# EAGLE design NOS01 (EAGLE 7.2.0)
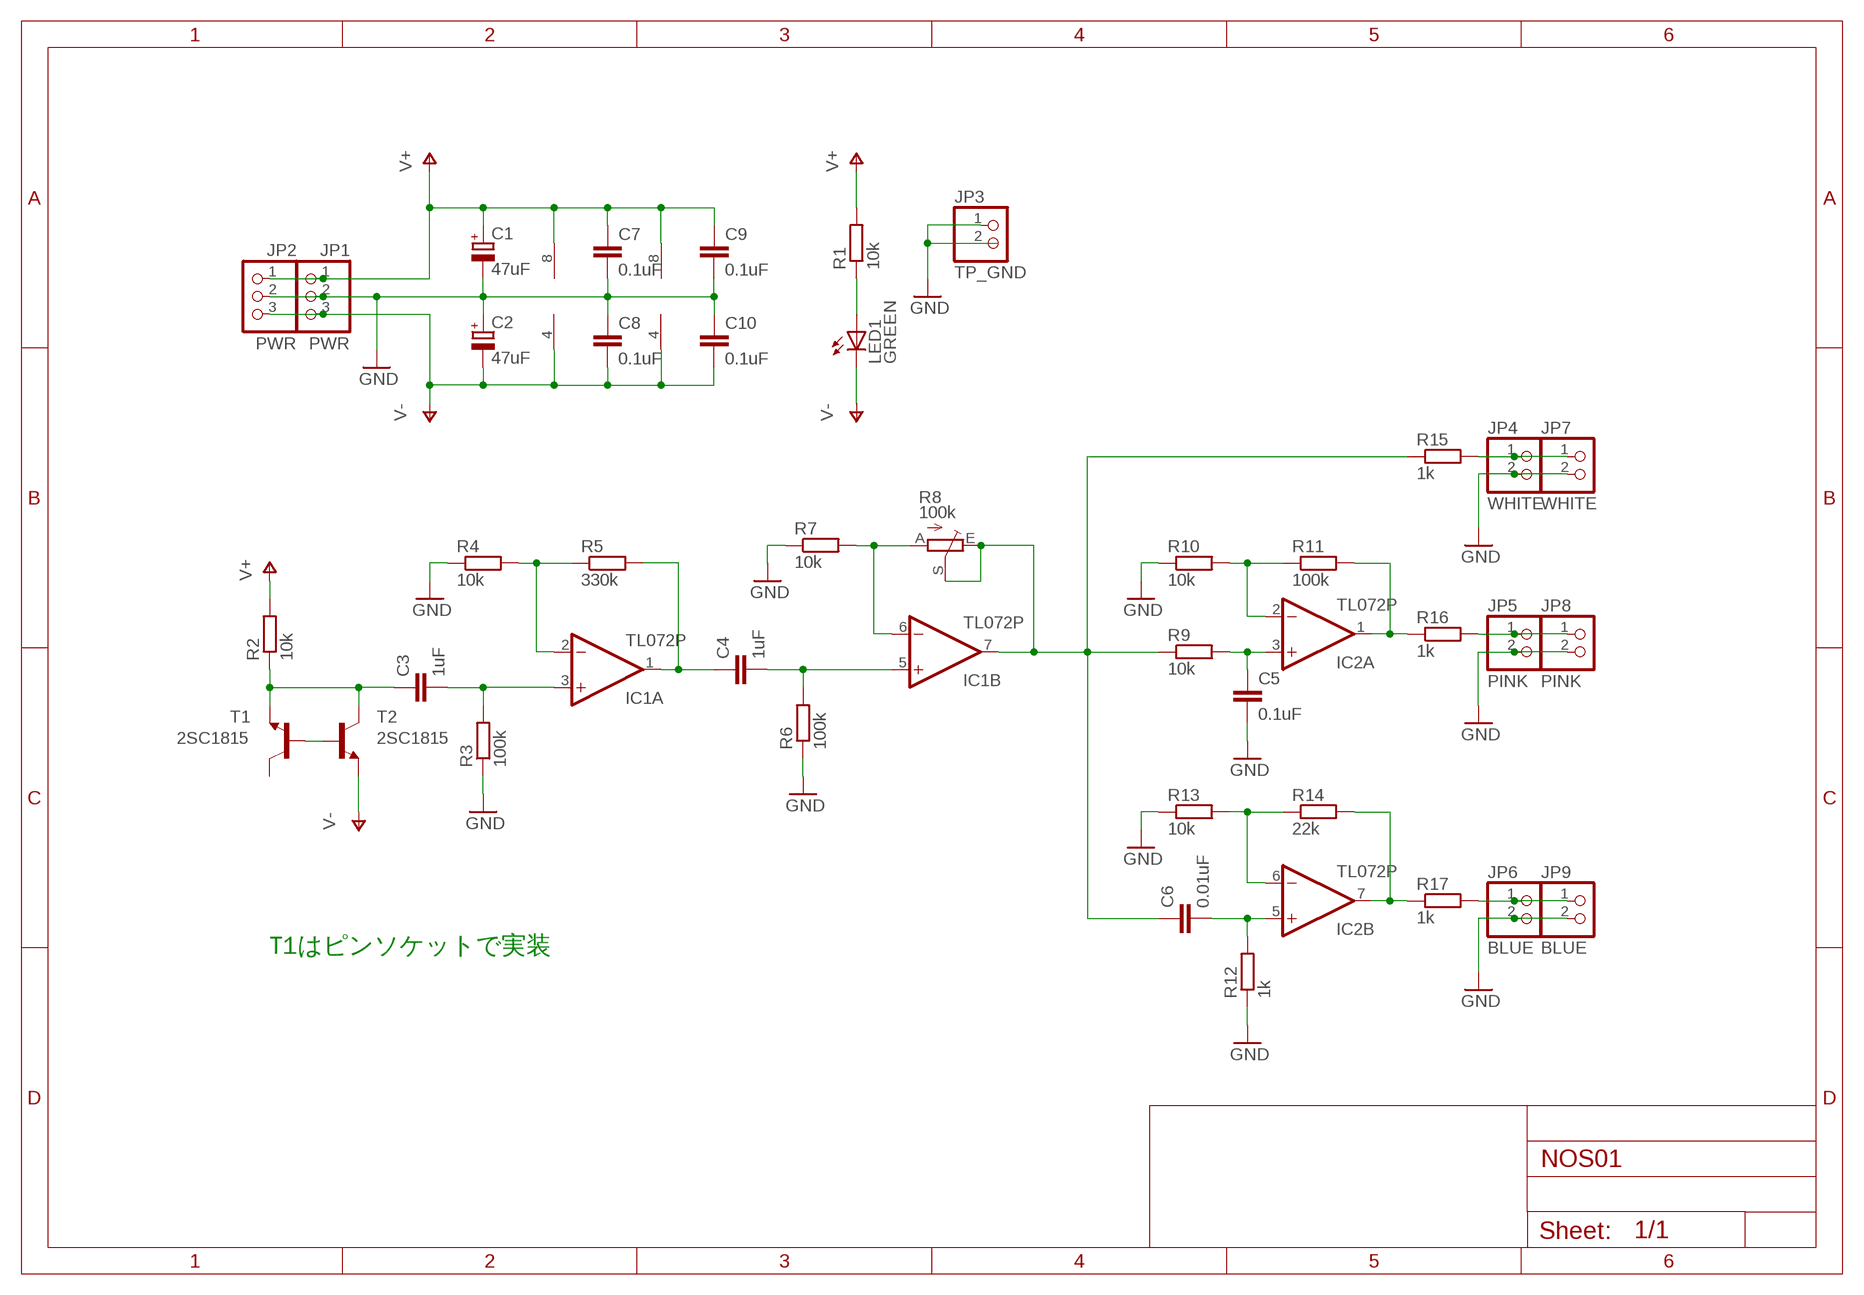
[diagram p0: schematic, sheet 1]

## Parts
C1  47uF  CPOL-EUE2.5-6  [E2,5-6]
C2  47uF  CPOL-EUE2.5-6  [E2,5-6]
C3  1uF  C-EU050-045X075  [C050-045X075]
C4  1uF  C-EU050-045X075  [C050-045X075]
C5  0.1uF  C-EU075-052X106  [C075-052X106]
C6  0.01uF  C-EU050-045X075  [C050-045X075]
C7  0.1uF  C-EU025-024X044  [C025-024X044]
C8  0.1uF  C-EU025-024X044  [C025-024X044]
C9  0.1uF  C-EU025-024X044  [C025-024X044]
C10  0.1uF  C-EU025-024X044  [C025-024X044]
IC1  TL072P  [DIL08]
IC2  TL072P  [DIL08]
JP1  PWR  PINHD-1X3  [1X03]
JP2  PWR  PINHD-1X3  [1X03]
JP3  TP_GND  PINHD-1X2  [1X02]
JP4  WHITE  PINHD-1X2  [1X02]
JP5  PINK  PINHD-1X2  [1X02]
JP6  BLUE  PINHD-1X2  [1X02]
JP7  WHITE  PINHD-1X2  [1X02]
JP8  PINK  PINHD-1X2  [1X02]
JP9  BLUE  PINHD-1X2  [1X02]
LED1  GREEN  LED3MM  [LED3MM]
R1  10k  R-EU_0207/7  [0207/7]
R2  10k  R-EU_0207/7  [0207/7]
R3  100k  R-EU_0207/7  [0207/7]
R4  10k  R-EU_0207/7  [0207/7]
R5  330k  R-EU_0207/7  [0207/7]
R6  100k  R-EU_0207/7  [0207/7]
R7  10k  R-EU_0207/7  [0207/7]
R8  100k  TRIM_EU-B25P  [B25P]
R9  10k  R-EU_0207/7  [0207/7]
R10  10k  R-EU_0207/7  [0207/7]
R11  100k  R-EU_0207/7  [0207/7]
R12  1k  R-EU_0207/7  [0207/7]
R13  10k  R-EU_0207/7  [0207/7]
R14  22k  R-EU_0207/7  [0207/7]
R15  1k  R-EU_0207/7  [0207/7]
R16  1k  R-EU_0207/7  [0207/7]
R17  1k  R-EU_0207/7  [0207/7]
T1  2SC1815  -NPN-TO92-ECB  [TO92-ECB]
T2  2SC1815  -NPN-TO92-ECB  [TO92-ECB]

## Nets
GND: C1.- C2.+ C5.2 C7.2 C8.1 C9.2 C10.1 JP1.2 JP2.2 JP3.1 JP3.2 JP4.2 JP5.2 JP6.2 JP7.2 JP8.2 JP9.2 R3.1 R4.1 R6.1 R7.1 R10.1 R12.1 R13.1
N$1: T1.B T2.B
N$2: C3.1 R2.1 T1.E T2.C
N$3: C3.2 IC1.3(A:+IN) R3.2
N$4: LED1.A R1.1
N$5: IC1.2(A:-IN) R4.2 R5.1
N$6: IC2.2(A:-IN) R10.2 R11.1
N$7: C4.1 IC1.1(A:OUT) R5.2
N$8: C4.2 IC1.5(B:+IN) R6.2
N$9: IC1.6(B:-IN) R7.2 R8.A
N$10: C6.1 IC1.7(B:OUT) R8.E R8.S R9.1 R15.1
N$11: IC2.1(A:OUT) R11.2 R16.1
N$12: JP5.1 JP8.1 R16.2
N$13: C5.1 IC2.3(A:+IN) R9.2
N$14: IC2.6(B:-IN) R13.2 R14.1
N$15: IC2.7(B:OUT) R14.2 R17.1
N$17: C6.2 IC2.5(B:+IN) R12.2
N$18: JP4.1 JP7.1 R15.2
N$21: JP6.1 JP9.1 R17.2
V+: C1.+ C7.1 C9.1 IC1.8(P:V+) IC2.8(P:V+) JP1.1 JP2.1 R1.2 R2.2
V-: C2.- C8.2 C10.2 IC1.4(P:V-) IC2.4(P:V-) JP1.3 JP2.3 LED1.K(C) T2.E
Unconnected: T1.C

## Notes on the sheet
- T1はピンソケットで実装

## Library data of the parts
C1 C2 = rcl:CPOL-EU: POLARIZED CAPACITOR, European symbol
C3-C10 = rcl:C-EU: CAPACITOR, European symbol
IC1 IC2 = linear:TL072: OP AMP
JP1 JP2 = pinhead:PINHD-1X3: PIN HEADER
JP3-JP9 = pinhead:PINHD-1X2: PIN HEADER
LED1 = led:LED: LED OSRAM: - CHIPLED LG R971, LG N971, LY N971, LG Q971, LY Q971, LO R971, LY R971 LH N974, LH R974 LS Q976, LO Q976, LY Q976 LO Q996 - Hyper CHIPLED LW Q18S LB Q993, LB Q99A, LB R99A - SideLED LS A670, LO A670, LY A670, LG A670, LP A670 LB A673, LV A673, LT A673, LW A673 LH A674 LY A675 LS A676, LA A676, LO A676, LY A676, LW A676 LS A679, LY A679, LG A679 - Hyper Micro SIDELED® LS Y876, LA Y876, LO Y876, LY Y876 LT Y87S - SmartLED LW L88C, LW L88S LB L89C, LB L89S, LG L890 LS L89K, LO L89K, LY L89K LS L896, LA L896, LO L896, LY L896 - TOPLED LS T670, LO T670, LY T670, LG T670, LP T670 LSG T670, LSP T670, LSY T670, LOP T670, LYG T670 LG T671, LOG T671, LSG T671 LB T673, LV T673, LT T673, LW T673 LH T674 LS T676, LA T676, LO T676, LY T676, LB T676, LH T676, LSB T676, LW T676 LB T67C, LV T67C, LT T67C, LS T67K, LO T67K, LY T67K, LW E67C LS E67B, LA E67B, LO E67B, LY E67B, LB E67C, LV E67C, LT E67C LW T67C LS T679, LY T679, LG T679 LS T770, LO T770, LY T770, LG T770, LP T770 LB T773, LV T773, LT T773, LW T773 LH T774 LS E675, LA E675, LY E675, LS T675 LS T776, LA T776, LO T776, LY T776, LB T776 LHGB T686 LT T68C, LB T68C - Hyper Mini TOPLED® LB M676 - Mini TOPLED Santana® LG M470 LS M47K, LO M47K, LY M47K Source: http://www.osram.convergy.de LUXEON: - LUMILED® LXK2-PW12-R00, LXK2-PW12-S00, LXK2-PW14-U00, LXK2-PW14-V00 LXK2-PM12-R00, LXK2-PM12-S00, LXK2-PM14-U00 LXK2-PE12-Q00, LXK2-PE12-R00, LXK2-PE12-S00, LXK2-PE14-T00, LXK2-PE14-U00 LXK2-PB12-K00, LXK2-PB12-L00, LXK2-PB12-M00, LXK2-PB14-N00, LXK2-PB14-P00, LXK2-PB14-Q00 LXK2-PR12-L00, LXK2-PR12-M00, LXK2-PR14-Q00, LXK2-PR14-R00 LXK2-PD12-Q00, LXK2-PD12-R00, LXK2-PD12-S00 LXK2-PH12-R00, LXK2-PH12-S00 LXK2-PL12-P00, LXK2-PL12-Q00, LXK2-PL12-R00 Source: www.luxeon.com KINGBRIGHT: KA-3528ASYC Source: www.kingbright.com
R1-R7 R9-R17 = rcl:R-EU_: RESISTOR, European symbol
R8 = pot:TRIM_EU-: POTENTIOMETER
T1 T2 = transistor:*-NPN-: NPN Transistror BF959 corrected 2008.03.06

## Board
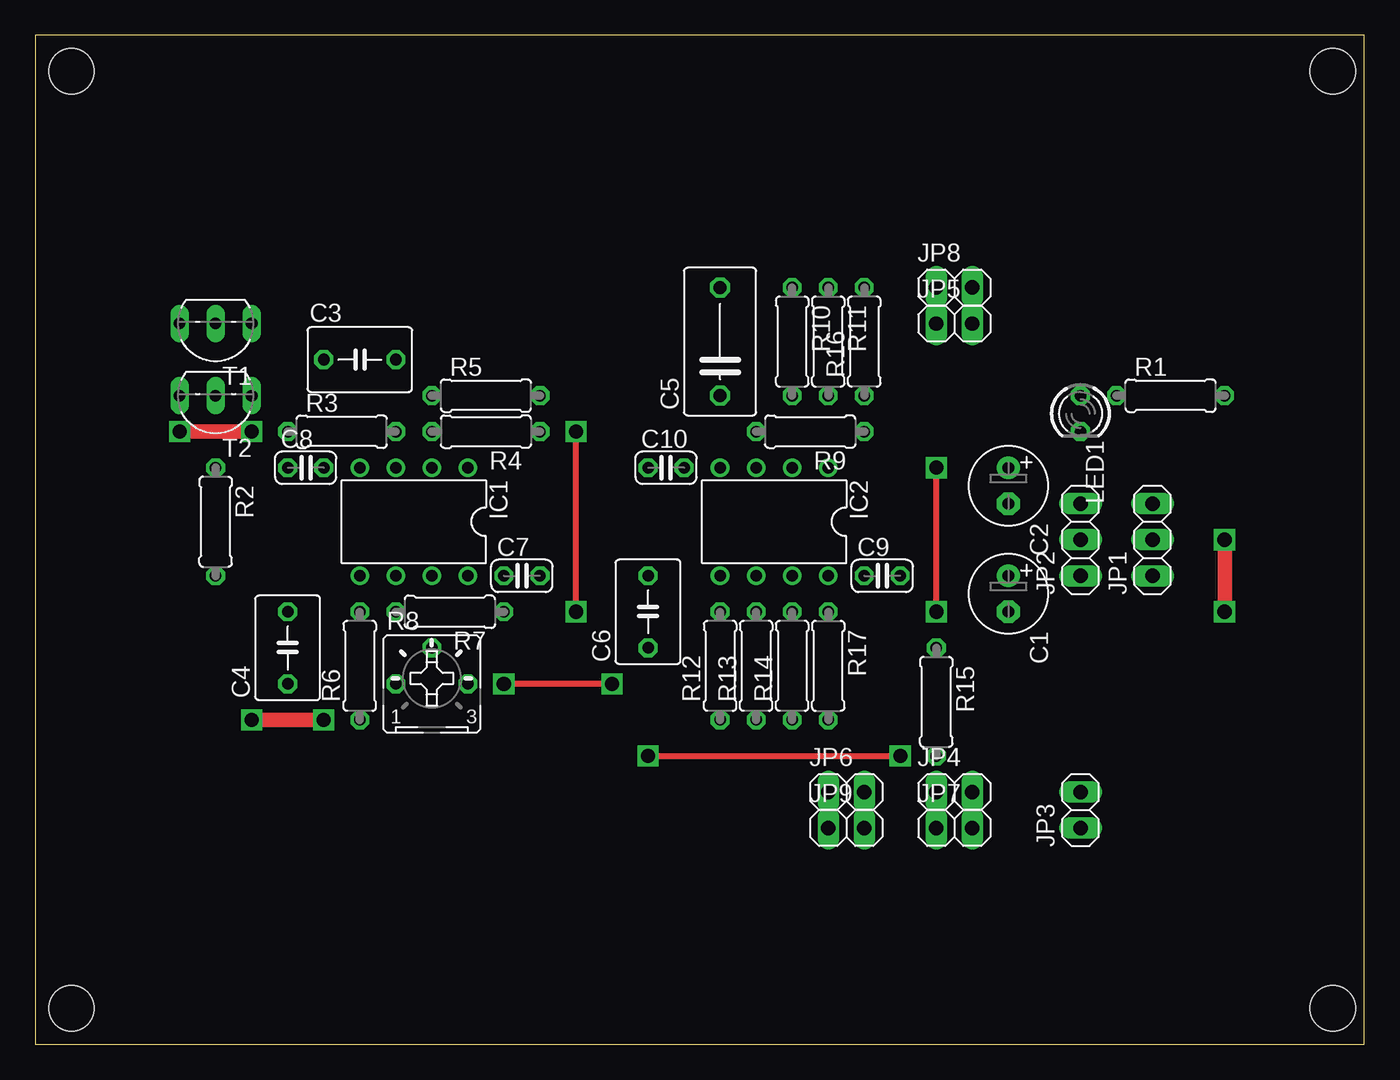
[diagram p1: board, top side]
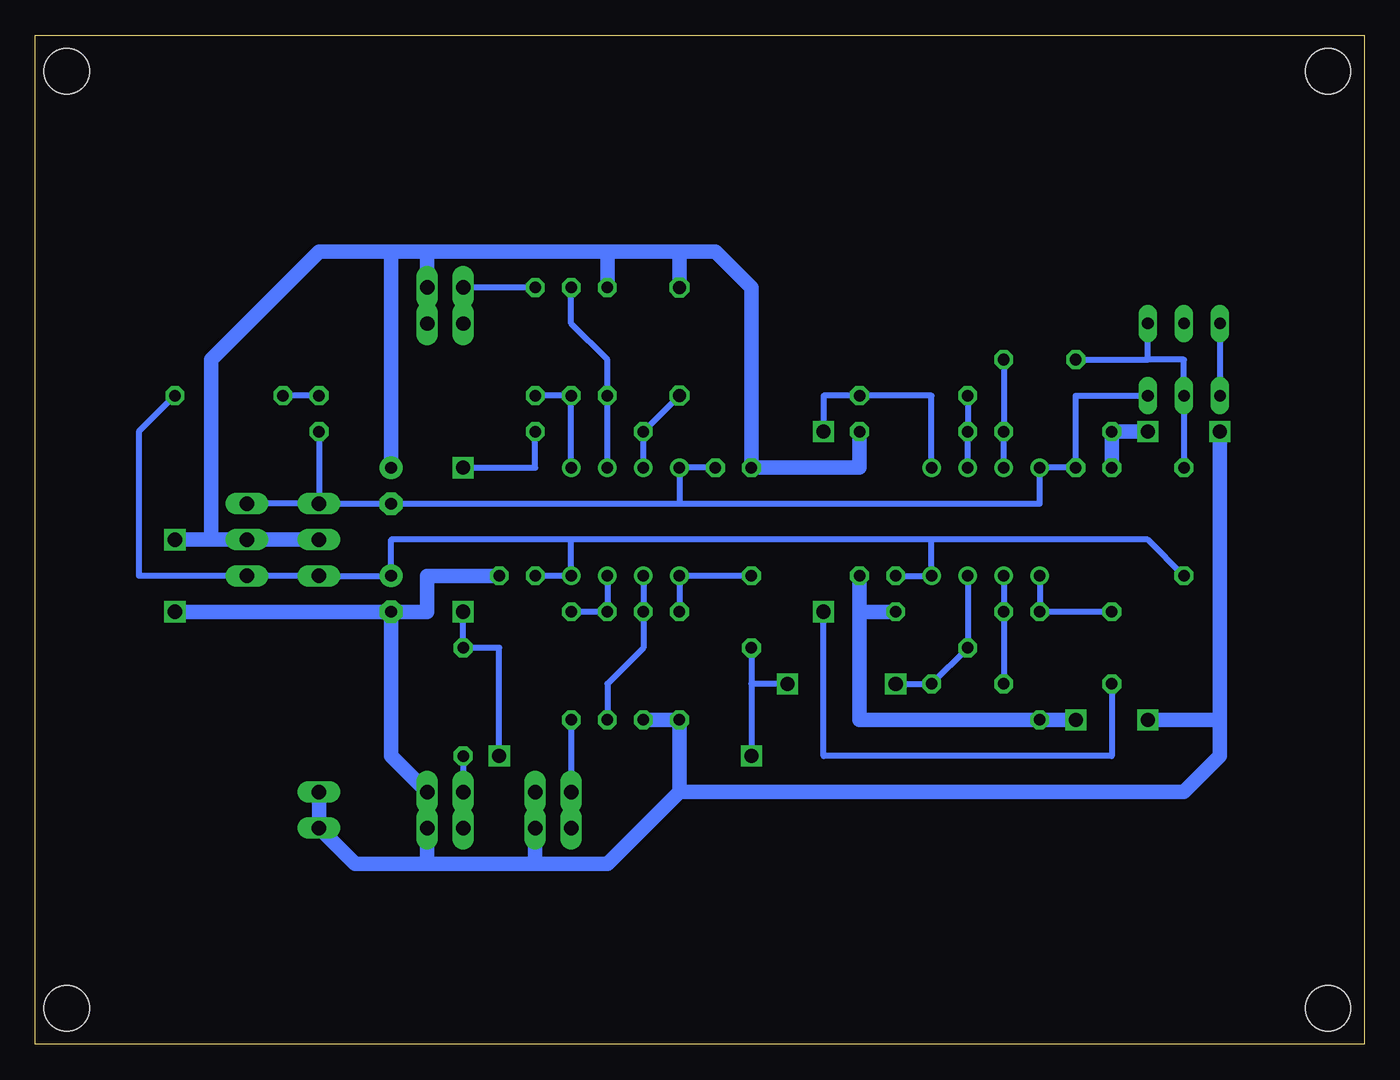
[diagram p2: board, bottom side, seen from below]

Size 93.65 x 71.11 mm. Coordinates in mm from the lower left corner, seen from the top.
Outline: 0,0 93.65,0 93.65,71.11 0,71.11 0,0
Copper layers (1*16): Top 0.035mm / dielectric 1.5mm / Bottom 0.035mm
Design rules "default": minimum track width 10mil, minimum drill 24mil, track to track 8mil, track to pad 8mil, pad to pad 8mil, via to via 8mil, smd to smd 8mil, copper to edge 40mil, drill to drill 8mil, minimum pad ring 10mil, minimum via ring 8mil, stop-mask expansion 4mil, vias tented up to drill 0mil, thermal gap 10mil
Holes 3.2 mm at 2.54,68.58 2.54,2.54 91.44,68.58 91.44,2.54

### Footprints (pad centres in the part's own frame; a part is rotated, then mirrored left to right if it is on the bottom)
E2,5-6 = drill 0.813 pad 1.6: + -1.27,0 | drill 0.813 pad 1.6 octagon: - 1.27,0
C050-045X075 = drill 0.813 octagon: 1 -2.54,0; 2 2.54,0
C075-052X106 = drill 0.914 octagon: 1 -3.81,0; 2 3.81,0
C025-024X044 = drill 0.813 octagon: 1 -1.27,0; 2 1.27,0
DIL08 = drill 0.813 pad 1.27: 1 -3.81,-3.81; 2 -1.27,-3.81; 3 1.27,-3.81; 4 3.81,-3.81; 5 3.81,3.81; 6 1.27,3.81; 7 -1.27,3.81; 8 -3.81,3.81
1X03 = drill 1.016 long: 1 -2.54,0; 2 0,0; 3 2.54,0
1X02 = drill 1.016 long: 1 -1.27,0; 2 1.27,0
LED3MM = drill 0.813 octagon: A -1.27,0; K 1.27,0
0207/7 = drill 0.813 octagon: 1 -3.81,0; 2 3.81,0
B25P = drill 0.813 octagon: A -2.54,0; E 2.54,0; S 0,2.54
TO92-ECB = drill 0.813 long: B 2.54,0; C 0,0; E -2.54,0

### Placement (x,y rotation side)
C1  68.58,31.75 270 top
C2  68.58,39.37 270 top
C3  22.86,48.26 0 top
C4  17.78,27.94 90 top
C5  48.26,49.53 90 top
C6  43.18,30.48 90 top
C7  34.29,33.02 0 top
C8  19.05,40.64 0 top
C9  59.69,33.02 0 top
C10  44.45,40.64 0 top
IC1  26.67,36.83 180 top
IC2  52.07,36.83 180 top
JP1  78.74,35.56 90 top
JP2  73.66,35.56 90 top
JP3  73.66,16.51 90 top
JP4  64.77,17.78 0 top
JP5  64.77,50.8 0 top
JP6  57.15,17.78 0 top
JP7  64.77,15.24 0 top
JP8  64.77,53.34 0 top
JP9  57.15,15.24 0 top
LED1  73.66,44.45 270 top
R1  80.01,45.72 0 top
R2  12.7,36.83 270 top
R3  21.59,43.18 0 top
R4  31.75,43.18 180 top
R5  31.75,45.72 0 top
R6  22.86,26.67 90 top
R7  29.21,30.48 180 top
R8  27.94,25.4 0 top
R9  54.61,43.18 180 top
R10  53.34,49.53 270 top
R11  55.88,49.53 270 top
R12  48.26,26.67 90 top
R13  50.8,26.67 90 top
R14  53.34,26.67 90 top
R15  63.5,24.13 270 top
R16  58.42,49.53 90 top
R17  55.88,26.67 270 top
T1  12.7,50.8 180 top
T2  12.7,45.72 180 top

### Tracks (layer width: path | path; a pad name or v marks a point on that pad's centre or on a via)
GND  (via drill 1)
  Top 1.016: v15.24,43.18 v10.16,43.18 | v20.32,22.86 v15.24,22.86 | v83.82,35.56 v83.82,30.48
  Bottom 1.016: C8.1 R3.1 v15.24,43.18 | R7.1 35.56,30.48 | 35.56,30.48 C7.2 | 10.16,22.86 10.16,20.32 12.7,17.78 48.26,17.78 | 10.16,22.86 v10.16,43.18 | v20.32,22.86 R6.1 35.56,22.86 35.56,30.48 | R4.1 35.56,40.64 C10.1 43.18,53.34 45.72,55.88 48.26,55.88 | R13.1 R12.1 48.26,17.78 | 58.42,12.7 JP9.2 JP6.2 | 58.42,12.7 53.34,12.7 48.26,17.78 | 66.04,12.7 71.12,12.7 JP3.1 JP3.2 | 66.04,12.7 JP7.2 JP4.2 68.58,20.32 C1.- | 58.42,12.7 66.04,12.7 | 66.04,55.88 JP8.2 JP5.2 | JP2.2 JP1.2 81.28,35.56 | 66.04,55.88 68.58,55.88 | 68.58,55.88 73.66,55.88 81.28,48.26 81.28,35.56 | 81.28,35.56 v83.82,35.56 | C1.- v83.82,30.48 | C9.2 66.04,33.02 66.04,30.48 C1.- | C2.+ 68.58,55.88 | 48.26,55.88 53.34,55.88 | 53.34,55.88 66.04,55.88 | R10.1 53.34,55.88 | C5.2 48.26,55.88 | v15.24,22.86 10.16,22.86
N$1
  Bottom 0.406: T1.B T2.B
N$2
  Bottom 0.406: 15.24,48.26 12.7,48.26 T2.C R2.1 | 15.24,48.26 T1.E | C3.1 15.24,48.26
N$3
  Bottom 0.406: C3.2 R3.2 IC1.3
N$4
  Bottom 0.406: LED1.A R1.1
N$5
  Bottom 0.406: IC1.2 R4.2 R5.1
N$6
  Bottom 0.406: IC2.2 R10.2 53.34,48.26 55.88,50.8 R11.1
N$7  (via drill 1)
  Top 0.406: v38.1,30.48 v38.1,43.18
  Bottom 0.406: C4.1 17.78,20.32 38.1,20.32 v38.1,30.48 | v38.1,43.18 38.1,45.72 R5.2 30.48,45.72 IC1.1
N$8
  Bottom 0.406: C4.2 R6.2 IC1.5
N$9
  Bottom 0.406: IC1.6 R7.2 R8.A
N$10  (via drill 1)
  Top 0.406: v40.64,25.4 v33.02,25.4 | v43.18,20.32 v60.96,20.32 | v63.5,30.48 v63.5,40.64
  Bottom 0.406: IC1.7 R8.S R8.E v33.02,25.4 | C6.1 43.18,25.4 | 43.18,25.4 v43.18,20.32 | v60.96,20.32 60.96,27.94 R15.1 v63.5,30.48 | v40.64,25.4 43.18,25.4 | v63.5,40.64 58.42,40.64 R9.1
N$11
  Bottom 0.406: IC2.1 R11.2 R16.1
N$12
  Bottom 0.406: JP5.1 JP8.1 R16.2
N$13
  Bottom 0.406: IC2.3 R9.2 C5.1
N$14
  Bottom 0.406: IC2.6 R13.2 50.8,27.94 53.34,25.4 R14.1
N$15
  Bottom 0.406: IC2.7 R14.2 R17.1
N$17
  Bottom 0.406: R12.2 IC2.5 C6.2
N$18
  Bottom 0.406: R15.2 JP4.1 JP7.1
N$21
  Bottom 0.406: R17.2 JP6.1 JP9.1
V+
  Bottom 0.406: 30.48,35.56 IC1.8 C7.1 | 30.48,35.56 55.88,35.56 | 55.88,35.56 68.58,35.56 C1.+ JP2.1 JP1.1 86.36,33.02 86.36,43.18 R1.2 | R2.2 15.24,35.56 30.48,35.56 | 55.88,35.56 IC2.8 C9.1
V-
  Bottom 0.406: 48.26,38.1 C2.- JP2.3 | 48.26,38.1 22.86,38.1 IC1.4 C8.2 20.32,45.72 T2.E | 48.26,38.1 IC2.4 C10.2 | JP2.3 JP1.3 | LED1.K JP2.3

### Text on the board
Document: Use Pin Socket